# Altium schematic sheet Etapa_Control_Ruido.schdoc
size A
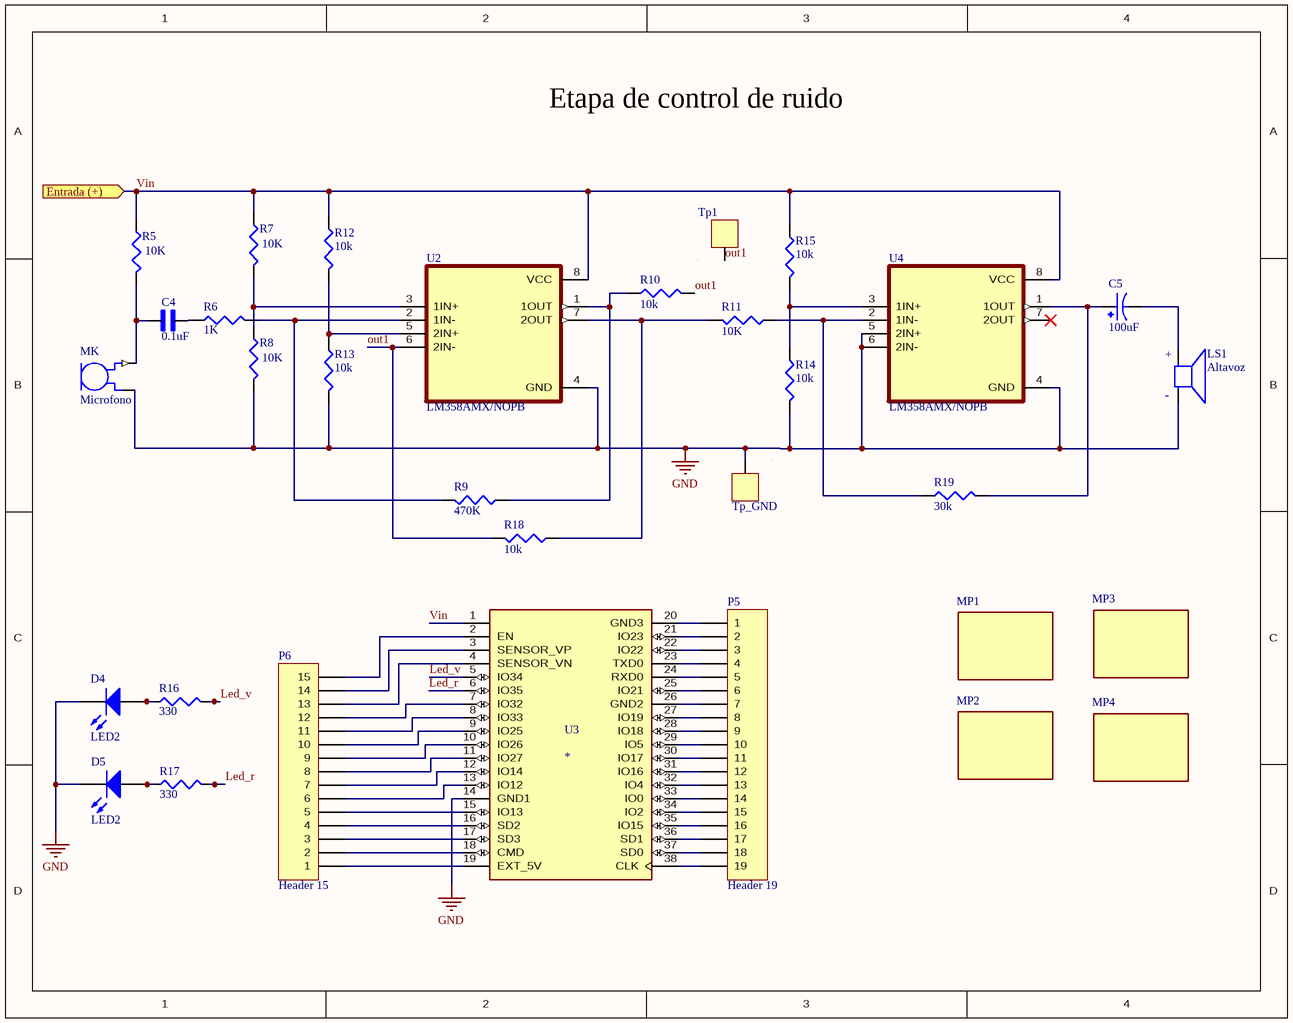
[diagram p0: Etapa_Control_Ruido.schdoc]

## Parts
C4  0.1uF  [CAPC4632X221N]
C5  100uF  [CAP_16SVPG220M]
D4  LED2  [3.2X1.6X1.1]
D5  LED2  [3.2X1.6X1.1]
LS1  Altavoz  [SPKR_AST-1732MR-R]
MK  Microfono  [CUI_CMA-6542PF]
MP1  5205980-1  [Tornillo]  (value not drawn)
MP2  5205980-1  [Tornillo]  (value not drawn)
MP3  5205980-1  [Tornillo]  (value not drawn)
MP4  5205980-1  [Tornillo]  (value not drawn)
P5  Header 19  [HDR1X19]
P6  Header 15  [HDR1X15]
R5  value 10K  [J1-0805]  (hidden comment: Res3)
R6  value 1K  [J1-0805]  (hidden comment: Res3)
R7  value 10K  [J1-0805]  (hidden comment: Res3)
R8  value 10K  [J1-0805]  (hidden comment: Res3)
R9  value 470K  [J1-1206]  (hidden comment: Res3)
R10  value 10k  [J1-0805]  (hidden comment: Res3)
R11  value 10K  [J1-0805]  (hidden comment: Res3)
R12  value 10k  [J1-0805]  (hidden comment: Res3)
R13  value 10k  [J1-0805]  (hidden comment: Res3)
R14  value 10k  [J1-0805]  (hidden comment: Res3)
R15  value 10k  [J1-0805]  (hidden comment: Res3)
R16  value 330  [J1-0805]  (hidden comment: Res3)
R17  value 330  [J1-0805]  (hidden comment: Res3)
R18  value 10k  [J1-0805]  (hidden comment: Res3)
R19  value 30k  [J1-0805]  (hidden comment: Res3)
Tp1  Test_point  [Test_Point]  (value not drawn)
Tp_GND  Test_point  [Test_point_GND]  (value not drawn)
U2  LM358AMX/NOPB  [SOIC127P599X175-8N]
U3  *  [MODULE_ESP32-DEVKITC-32D]
U4  LM358AMX/NOPB  [SOIC127P599X175-8N]

## Ports
Entrada (+) (in)

## Nets
GND: D4.2(K) D5.2(K) LS1.2(NEG) MK.2 R8.2 R13.2 R14.2 Tp_GND.1 U2.4(GND) U3.14(GND1) U4.4(GND) U4.5(2IN+) U4.6(2IN-)
Led_r: R17.2 U3.6(IO35)
Led_v: R16.2 U3.5(IO34)
out1: R10.2 R18.2 Tp1.1 U2.6(2IN-)
Vin: R5.1 R7.1 R12.1 R15.1 U2.8(VCC) U3.1(3V3) U4.8(VCC) ; port Entrada (+)
NetC4_1: C4.1 R6.1
NetC4_2: C4.2 MK.1(OUT) R5.2
NetC5_1: C5.1 R19.2 U4.1(1OUT)
NetC5_2: C5.2 LS1.1(POS)
NetD4_1: D4.1(A) R16.1
NetD5_1: D5.1(A) R17.1
NetP5_1: P5.1 U3.20(GND3)
NetP5_2: P5.2 U3.21(IO23)
NetP5_3: P5.3 U3.22(IO22)
NetP5_4: P5.4 U3.23(TXD0)
NetP5_5: P5.5 U3.24(RXD0)
NetP5_6: P5.6 U3.25(IO21)
NetP5_7: P5.7 U3.26(GND2)
NetP5_8: P5.8 U3.27(IO19)
NetP5_9: P5.9 U3.28(IO18)
NetP5_10: P5.10 U3.29(IO5)
NetP5_11: P5.11 U3.30(IO17)
NetP5_12: P5.12 U3.31(IO16)
NetP5_13: P5.13 U3.32(IO4)
NetP5_14: P5.14 U3.33(IO0)
NetP5_15: P5.15 U3.34(IO2)
NetP5_16: P5.16 U3.35(IO15)
NetP5_17: P5.17 U3.36(SD1)
NetP5_18: P5.18 U3.37(SD0)
NetP5_19: P5.19 U3.38(CLK)
NetP6_1: P6.1 U3.19(EXT_5V)
NetP6_2: P6.2 U3.18(CMD)
NetP6_3: P6.3 U3.17(SD3)
NetP6_4: P6.4 U3.16(SD2)
NetP6_5: P6.5 U3.15(IO13)
NetP6_6: P6.6 U3.13(IO12)
NetP6_7: P6.7 U3.12(IO14)
NetP6_8: P6.8 U3.11(IO27)
NetP6_9: P6.9 U3.10(IO26)
NetP6_10: P6.10 U3.9(IO25)
NetP6_11: P6.11 U3.8(IO33)
NetP6_12: P6.12 U3.7(IO32)
NetP6_13: P6.13 U3.4(SENSOR_VN)
NetP6_14: P6.14 U3.3(SENSOR_VP)
NetP6_15: P6.15 U3.2(EN)
NetR6_2: R6.2 R9.2 U2.2(1IN-)
NetR7_2: R7.2 R8.1 U2.3(1IN+)
NetR9_1: R9.1 R10.1 U2.1(1OUT)
NetR11_1: R11.1 R19.1 U4.2(1IN-)
NetR11_2: R11.2 R18.1 U2.7(2OUT)
NetR12_2: R12.2 R13.1 U2.5(2IN+)
NetR14_1: R14.1 R15.2 U4.3(1IN+)

Not connected (* = marked no-connect by the designer): U4 7(2OUT)*

## Notes on the sheet
- Etapa de control de ruido
- (in symbol AST-1732MR-R) +; -

## Library data of the parts
C4 = 1812CC104KAZ1A: CAP,CERM,0.10UF,630V,X7R,1812; Dielectric Characteristic:X7R; Capacitance:100nF; Capacitance Tolerance:Â± 10%; Voltage Rating:630V; Temperature Coefficient:Â± 15%; Series:LT; Capacitor Case Style:1812; No. of Pins:2; Mounting Type:SMD; Operating Temperature Range:-55Â°C to +125Â°C; SVHC:No SVHC (18-Jun-2010); Package: None; Price: None; Value: *; MP: 1812CC104KAZ1A; Availability: Unavailable
C5 = 16SVPG220M: MP: 16SVPG220M; Price: None; Package: None; Value: *; Availability: Unavailable
D4 D5 = LED2: Typical RED, GREEN, YELLOW, AMBER GaAs LED; Published: 8-Jun-2000; LatestRevisionDate: 17-Jul-2002; LatestRevisionNote: Re-released for DXP Platform.; PackageVersion: Feb-2002; PackageReference: 3.2X1.6X1.1; Publisher: Altium Limited; PackageDescription: SM LED; 2 Flat Leads
LS1 = AST-1732MR-R: æ‰¬å£°å™¨.2W 32æ¬§å§†90DBA 1700HZ; MF: PUI Audio; Purchase-URL: https://pricing.snapeda.com/search/part/AST-1732MR-R/?ref=eda; Check_prices: https://www.snapeda.com/parts/AST-1732MR-R/PUI+Audio/view-part/?ref=eda; Value: *; Package: None; Price: None; Availability: In Stock; MP: AST-1732MR-R; SnapEDA_Link: https://www.snapeda.com/parts/AST-1732MR-R/PUI+Audio/view-part/?ref=snap
MK = CMA-6542PF: 9.7 mm, Omnidirectional, PCB Mount, 4.5 Vdc, Electret Condenser Microphone; MF: CUI Devices; Value: *; Price: None; Package: CUI Inc.; CUI_purchase_URL: https://www.cuidevices.com/product/audio/microphones/electret-condenser-microphones/cma-6542pf?utm_source=snapeda.com&utm_medium=referral&utm_campaign=snapedaBOM; SnapEDA_Link: https://www.snapeda.com/parts/CMA-6542PF/CUI%20Devices/view-part/316835/?ref=snap; Availability: Unavailable; MP: CMA-6542PF
MP1-MP4 = CMP-03367-000025-1: CONN D-SUB SCREW RETAINER MALE; ELV: Compliant; Length: 7.1mm; Mount: Screw; Color: Yellow; Lead Free: Lead Free; Depth: 6.35mm; Series: AMPLIMITE; Packaging: Bag; Gender: Male; RoHS Compliant: Yes; Package Quantity: 1; REACH SVHC: No SVHC; Radiation Hardening: No; Material: Steel
P5 = Header 19: Header, 19-Pin; LatestRevisionDate: 17-Jul-2002; LatestRevisionNote: Re-released for DXP Platform.; Publisher: Altium Limited
P6 = Header 15: Header, 15-Pin; LatestRevisionDate: 17-Jul-2002; LatestRevisionNote: Re-released for DXP Platform.; Publisher: Altium Limited
R5-R19 = Res3: Resistor; Published: 8-Jun-2000; LatestRevisionDate: 29-May-2009; LatestRevisionNote: IPC-7351 Footprint Added.; PackageReference: J1-0603; Publisher: Altium Limited; PackageDescription: Chip Resistor
U2 U4 = LM358AMX/NOPB: 2-Channel, 1MHz, industry standard, 32V op amp 8-SOIC 0 to 70; MF: Texas Instruments; Value: *; MP: LM358AMX/NOPB; Availability: Good; Package: SOIC-8 Texas Instruments; Purchase-URL: https://pricing.snapeda.com/search/part/LM358AMX/NOPB/?ref=eda; SnapEDA_Link: https://www.snapeda.com/parts/LM358AMX/NOPB/Texas%20Instruments/view-part/18081/?ref=snap; Check_prices: https://www.snapeda.com/parts/LM358AMX/NOPB/Texas%20Instruments/view-part/18081/?ref=eda; Price: None
U3 = ESP32-DEVKITC-32D: EVAL BOARD FOR ESP-WROOM-32; MF: Espressif Systems; Value: *; MP: ESP32-DEVKITC-32D; Price: None; Check_prices: https://www.snapeda.com/parts/ESP32-DEVKITC-32D/Espressif%20Systems/view-part/2777395/?ref=eda; SnapEDA_Link: https://www.snapeda.com/parts/ESP32-DEVKITC-32D/Espressif%20Systems/view-part/2777395/?ref=snap; Availability: Warning; Purchase-URL: https://pricing.snapeda.com/search/part/ESP32-DEVKITC-32D/?ref=eda; Package: None